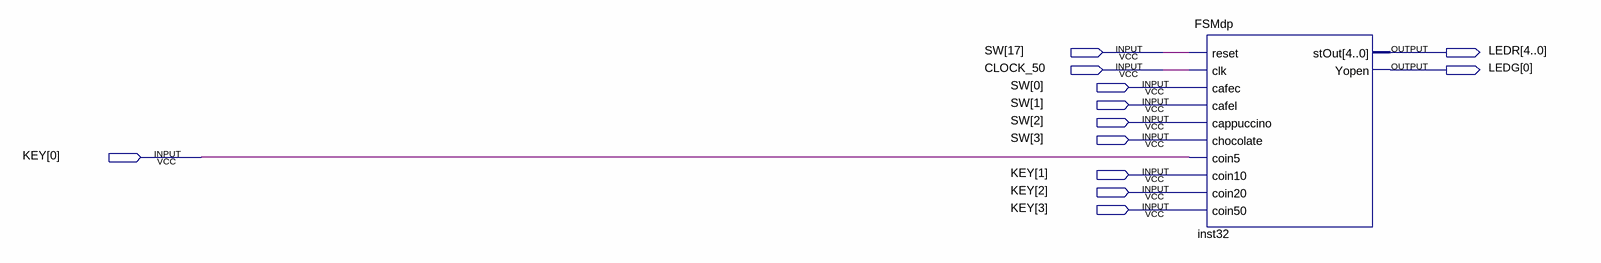
[diagram p0: schematic sheet]
// Quartus schematic tests.bdf as structural Verilog: 1 symbols, 12 pins
module tests (
  input  [17:0] SW,
  input  CLOCK_50,
  input  [3:0] KEY,
  output [4:0] LEDR,
  output [0:0] LEDG
);

  FSMdp inst32 (
    .reset(SW[17]), .clk(CLOCK_50), .cafec(SW[0]), .cafel(SW[1]), .cappuccino(SW[2]), .chocolate(SW[3]),
    .coin5(KEY[0]), .coin10(KEY[1]), .coin20(KEY[2]), .coin50(KEY[3]), .stOut(LEDR), .Yopen(LEDG[0]));
endmodule
